# Altium schematic sheet MicroSD.SchDoc
size A4; SheetNumber: 5; SheetTotal: 8
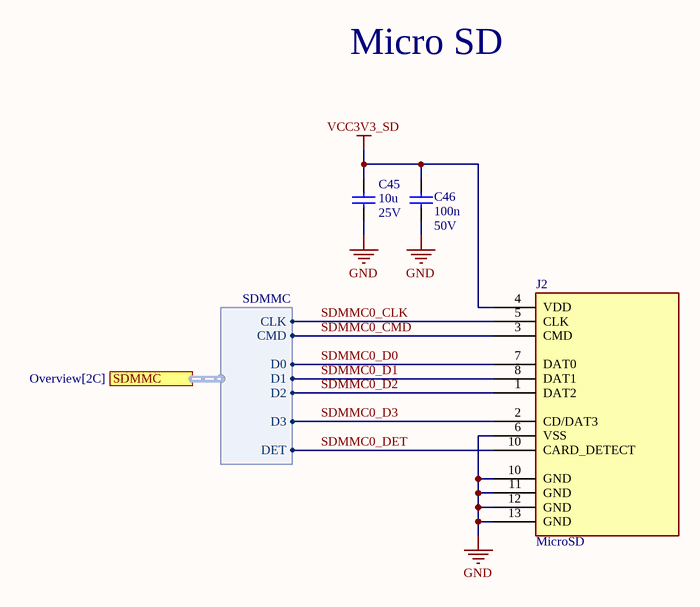
[diagram p0: MicroSD.SchDoc]

## Parts
C45  value 10u  Voltage: 25V  (hidden comment: GRM188R61E106MA73D)
C46  value 100n  Voltage: 50V  [GRM155R71H104KE14D]  (hidden comment: GRM155R71H104KE14D)
J2  MicroSD

## Ports
SDMMC (harness SDMMC, see Overview[2C])

## Harnesses
SDMMC: CLK, CMD, D0, D1, D3, D2, DET

## Nets
GND: C45.2 C46.2 J2.6(VSS) J2.10(GND) J2.11(GND) J2.12(GND) J2.13(GND)
VCC3V3_SD: C45.1 C46.1 J2.4(VDD)
SDMMC0_CLK: J2.5(CLK) ; port SDMMC.CLK
SDMMC0_CMD: J2.3(CMD) ; port SDMMC.CMD
SDMMC0_D0: J2.7(DAT0) ; port SDMMC.D0
SDMMC0_D1: J2.8(DAT1) ; port SDMMC.D1
SDMMC0_D2: J2.1(DAT2) ; port SDMMC.D2
SDMMC0_D3: J2.2(CD/DAT3) ; port SDMMC.D3
SDMMC0_DET: J2.10(CARD_DETECT) ; port SDMMC.DET

## Notes on the sheet
- Micro SD

## Library data of the parts
C45 = GRM188R61E106MA73D: CAP 10U 25V X5R 0603; Size: 0603; Dielectric: X5R
C46 = GRM155R71H104KE14D: CAP 100N 50V X7R 0402; Size: 0402; Dielectric: X7R; Manufacturer Part Number 1: GRM155R71H104KE14D